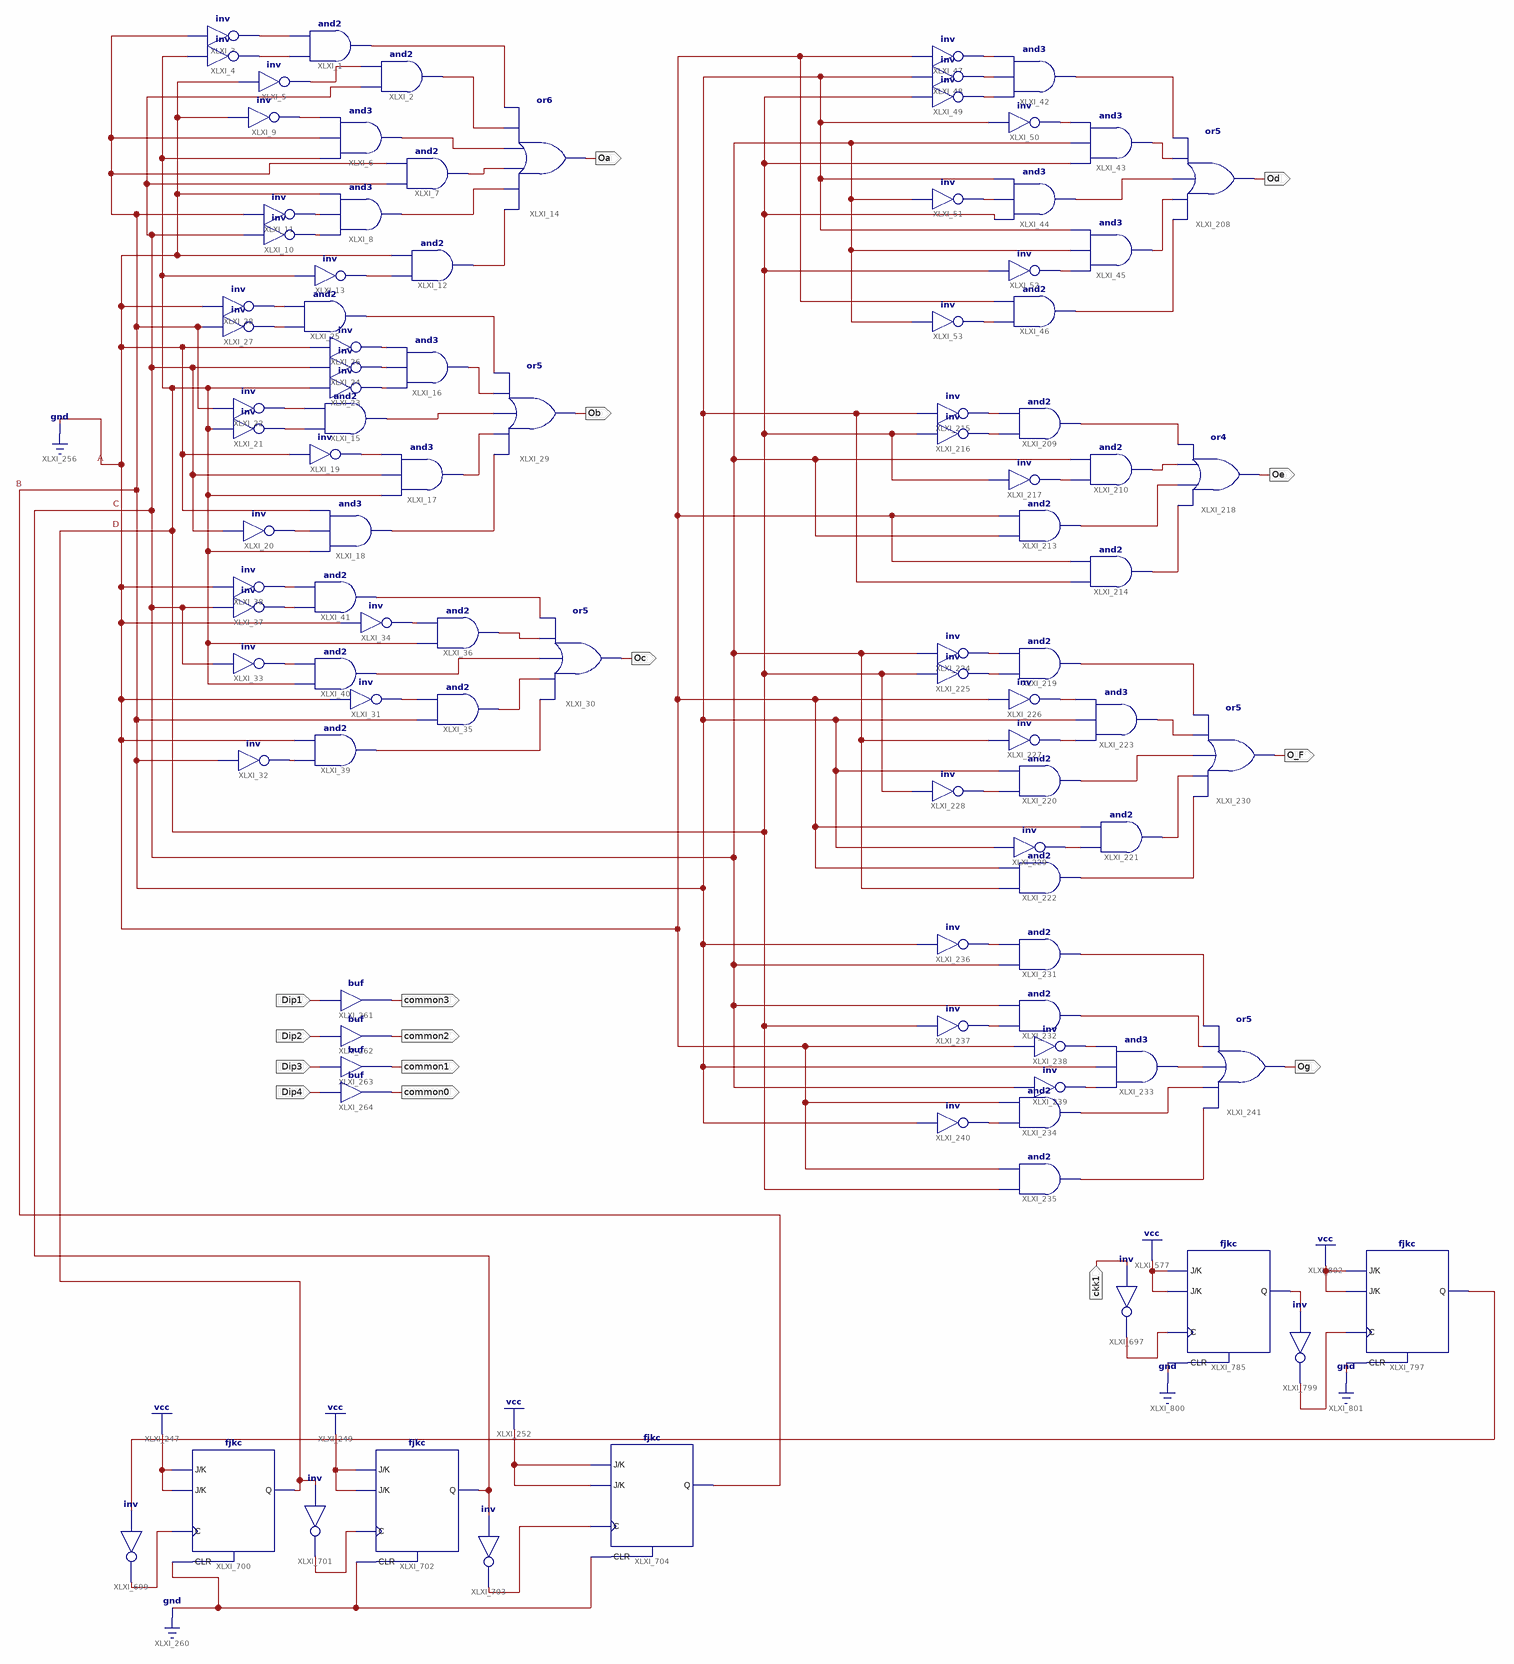
[diagram p0: schematic sheet 1]
// Xilinx ISE schematic lab8test2.sch (spartan6) as structural Verilog: 99 symbols, 16 ports
module lab8test2 (
  input  Dip1,
  input  Dip2,
  input  Dip3,
  input  Dip4,
  input  ckk1,
  output Oa,
  output Ob,
  output Oc,
  output Od,
  output Oe,
  output O_F,
  output Og,
  output common3,
  output common2,
  output common1,
  output common0
);

  wire B, C, D, XLXN_1, XLXN_2, XLXN_3, XLXN_4, XLXN_5, XLXN_6, XLXN_7, XLXN_8, XLXN_9, XLXN_10, XLXN_11,
       XLXN_12, XLXN_13, XLXN_14, XLXN_15, XLXN_17, XLXN_18, XLXN_19, XLXN_20, XLXN_21, XLXN_22, XLXN_23,
       XLXN_24, XLXN_25, XLXN_26, XLXN_27, XLXN_28, XLXN_35, XLXN_36, XLXN_37, XLXN_38, XLXN_39, XLXN_40,
       XLXN_41, XLXN_42, XLXN_43, XLXN_44, XLXN_45, XLXN_46, XLXN_47, XLXN_48, XLXN_49, XLXN_50, XLXN_51,
       XLXN_52, XLXN_53, XLXN_54, XLXN_55, XLXN_56, XLXN_57, XLXN_59, XLXN_90, XLXN_91, XLXN_263, XLXN_264,
       XLXN_265, XLXN_266, XLXN_268, XLXN_269, XLXN_270, XLXN_271, XLXN_272, XLXN_273, XLXN_279, XLXN_280,
       XLXN_281, XLXN_282, XLXN_283, XLXN_285, XLXN_286, XLXN_287, XLXN_288, XLXN_289, XLXN_300, XLXN_301,
       XLXN_302, XLXN_303, XLXN_304, XLXN_952, XLXN_954, XLXN_957, XLXN_958, XLXN_1045, XLXN_1047, XLXN_1052;

  and XLXI_1 (XLXN_8, XLXN_2, XLXN_1);
  and XLXI_2 (XLXN_9, C, XLXN_3);
  not XLXI_3 (XLXN_1, B);
  not XLXI_4 (XLXN_2, D);
  not XLXI_5 (XLXN_3, 1'b0);
  and XLXI_6 (XLXN_10, D, B, XLXN_4);
  and XLXI_7 (XLXN_11, C, B);
  and XLXI_8 (XLXN_12, XLXN_6, XLXN_5, 1'b0);
  not XLXI_9 (XLXN_4, 1'b0);
  not XLXI_10 (XLXN_6, C);
  not XLXI_11 (XLXN_5, B);
  and XLXI_12 (XLXN_13, XLXN_7, 1'b0);
  not XLXI_13 (XLXN_7, D);
  or XLXI_14 (Oa, XLXN_13, XLXN_12, XLXN_11, XLXN_10, XLXN_9, XLXN_8);
  and XLXI_15 (XLXN_26, XLXN_18, XLXN_19);
  and XLXI_16 (XLXN_25, XLXN_20, XLXN_21, XLXN_22);
  and XLXI_17 (XLXN_27, D, C, XLXN_17);
  and XLXI_18 (XLXN_28, D, XLXN_23, 1'b0);
  not XLXI_19 (XLXN_17, 1'b0);
  not XLXI_20 (XLXN_23, C);
  not XLXI_21 (XLXN_18, D);
  not XLXI_22 (XLXN_19, B);
  not XLXI_23 (XLXN_20, D);
  not XLXI_24 (XLXN_21, C);
  and XLXI_25 (XLXN_24, XLXN_15, XLXN_14);
  not XLXI_26 (XLXN_22, 1'b0);
  not XLXI_27 (XLXN_15, B);
  not XLXI_28 (XLXN_14, 1'b0);
  or XLXI_29 (Ob, XLXN_28, XLXN_27, XLXN_26, XLXN_25, XLXN_24);
  or XLXI_30 (Oc, XLXN_35, XLXN_36, XLXN_37, XLXN_38, XLXN_39);
  not XLXI_31 (XLXN_41, 1'b0);
  not XLXI_32 (XLXN_40, B);
  not XLXI_33 (XLXN_42, C);
  not XLXI_34 (XLXN_43, 1'b0);
  and XLXI_35 (XLXN_36, B, XLXN_41);
  and XLXI_36 (XLXN_38, D, XLXN_43);
  not XLXI_37 (XLXN_44, C);
  not XLXI_38 (XLXN_45, 1'b0);
  and XLXI_39 (XLXN_35, XLXN_40, 1'b0);
  and XLXI_40 (XLXN_37, D, XLXN_42);
  and XLXI_41 (XLXN_39, XLXN_44, XLXN_45);
  and XLXI_42 (XLXN_53, XLXN_50, XLXN_51, XLXN_52);
  and XLXI_43 (XLXN_54, D, C, XLXN_49);
  and XLXI_44 (XLXN_55, D, XLXN_48, B);
  and XLXI_45 (XLXN_56, XLXN_47, C, B);
  and XLXI_46 (XLXN_57, XLXN_46, 1'b0);
  not XLXI_47 (XLXN_52, 1'b0);
  not XLXI_48 (XLXN_51, B);
  not XLXI_49 (XLXN_50, D);
  not XLXI_50 (XLXN_49, B);
  not XLXI_51 (XLXN_48, C);
  not XLXI_52 (XLXN_47, D);
  not XLXI_53 (XLXN_46, C);
  or XLXI_208 (Od, XLXN_57, XLXN_56, XLXN_55, XLXN_54, XLXN_53);
  and XLXI_209 (XLXN_263, XLXN_90, XLXN_59);
  and XLXI_210 (XLXN_264, XLXN_91, C);
  and XLXI_213 (XLXN_265, C, 1'b0);
  and XLXI_214 (XLXN_266, B, 1'b0);
  not XLXI_215 (XLXN_59, B);
  not XLXI_216 (XLXN_90, D);
  not XLXI_217 (XLXN_91, D);
  or XLXI_218 (Oe, XLXN_266, XLXN_265, XLXN_264, XLXN_263);
  and XLXI_219 (XLXN_279, XLXN_269, XLXN_268);
  and XLXI_220 (XLXN_281, XLXN_272, B);
  and XLXI_221 (XLXN_282, XLXN_273, 1'b0);
  and XLXI_222 (XLXN_283, C, 1'b0);
  and XLXI_223 (XLXN_280, XLXN_271, B, XLXN_270);
  not XLXI_224 (XLXN_268, C);
  not XLXI_225 (XLXN_269, D);
  not XLXI_226 (XLXN_270, 1'b0);
  not XLXI_227 (XLXN_271, C);
  not XLXI_228 (XLXN_272, D);
  not XLXI_229 (XLXN_273, B);
  or XLXI_230 (O_F, XLXN_283, XLXN_282, XLXN_281, XLXN_280, XLXN_279);
  and XLXI_231 (XLXN_301, C, XLXN_289);
  and XLXI_232 (XLXN_302, XLXN_288, C);
  and XLXI_233 (XLXN_300, XLXN_286, B, XLXN_285);
  and XLXI_234 (XLXN_303, XLXN_287, 1'b0);
  and XLXI_235 (XLXN_304, D, 1'b0);
  not XLXI_236 (XLXN_289, B);
  not XLXI_237 (XLXN_288, D);
  not XLXI_238 (XLXN_285, 1'b0);
  not XLXI_239 (XLXN_286, C);
  not XLXI_240 (XLXN_287, B);
  or XLXI_241 (Og, XLXN_304, XLXN_303, XLXN_300, XLXN_302, XLXN_301);
  buf XLXI_261 (common3, Dip1);
  buf XLXI_262 (common2, Dip2);
  buf XLXI_263 (common1, Dip3);
  buf XLXI_264 (common0, Dip4);
  fjkc XLXI_700 (.C(XLXN_958), .CLR(1'b0), .J(1'b1), .K(1'b1), .Q(D));
  not XLXI_701 (XLXN_954, D);
  fjkc XLXI_702 (.C(XLXN_954), .CLR(1'b0), .J(1'b1), .K(1'b1), .Q(C));
  not XLXI_703 (XLXN_957, C);
  fjkc XLXI_704 (.C(XLXN_957), .CLR(1'b0), .J(1'b1), .K(1'b1), .Q(B));
  not XLXI_699 (XLXN_958, XLXN_1052);
  fjkc XLXI_785 (.C(XLXN_952), .CLR(1'b0), .J(1'b1), .K(1'b1), .Q(XLXN_1045));
  not XLXI_697 (XLXN_952, ckk1);
  fjkc XLXI_797 (.C(XLXN_1047), .CLR(1'b0), .J(1'b1), .K(1'b1), .Q(XLXN_1052));
  not XLXI_799 (XLXN_1047, XLXN_1045);
endmodule
